# EAGLE design buttons (EAGLE 9.6.2)
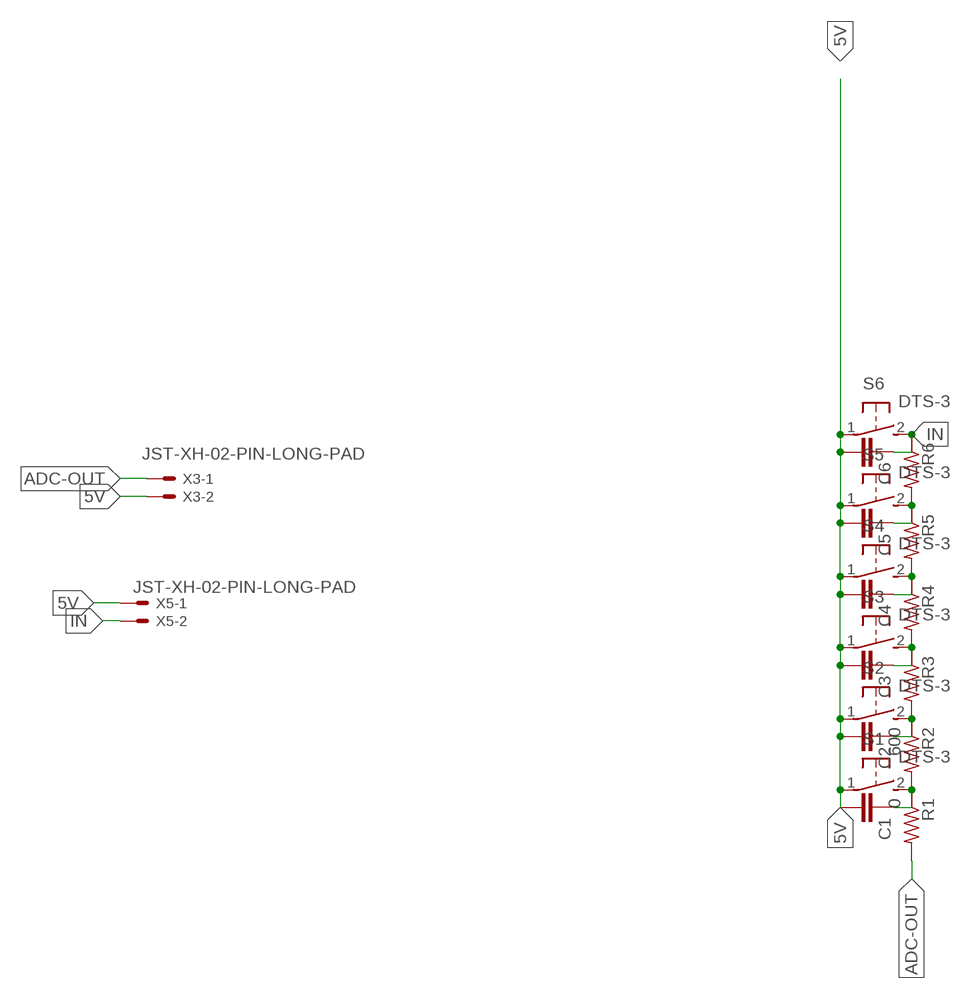
[diagram p0: schematic, sheet 1]

## Parts
C1  C-EU025-024X044  [C025-024X044]
C2  C-EU025-024X044  [C025-024X044]
C3  C-EU025-024X044  [C025-024X044]
C4  C-EU025-024X044  [C025-024X044]
C5  C-EU025-024X044  [C025-024X044]
C6  C-EU025-024X044  [C025-024X044]
R1  0  R-US_0204/7  [0204/7]
R2  600  R-US_0204/7  [0204/7]
R3  R-US_0204/7  [0204/7]
R4  R-US_0204/7  [0204/7]
R5  R-US_0204/7  [0204/7]
R6  R-US_0204/7  [0204/7]
S1  DTS-3  [DTS-3]
S2  DTS-3  [DTS-3]
S3  DTS-3  [DTS-3]
S4  DTS-3  [DTS-3]
S5  DTS-3  [DTS-3]
S6  DTS-3  [DTS-3]
X3  JST-XH-02-PIN-LONG-PAD  [JST-XH-02-PACKAGE-LONG-PAD]
X5  JST-XH-02-PIN-LONG-PAD  [JST-XH-02-PACKAGE-LONG-PAD]

## Nets
5V: C1.2 C2.2 C3.2 C4.2 C5.2 C6.2 S1.1 S2.1 S3.1 S4.1 S5.1 S6.1 X3.2 X5.1
ADC-OUT: R1.2 X3.1
IN: C6.1 R6.1 S6.2 X5.2
N$1: C1.1 R1.1 R2.2 S1.2
N$3: C2.1 R2.1 R3.2 S2.2
N$5: C3.1 R3.1 R4.2 S3.2
N$7: C4.1 R4.1 R5.2 S4.2
N$9: C5.1 R5.1 R6.2 S5.2

## Library data of the parts
C1-C6 = rcl:C-EU: CAPACITOR, European symbol; SPICEPREFIX: C
R1-R6 = rcl:R-US_: RESISTOR, American symbol; SPICEPREFIX: R
S1-S6 = switch-tact:DTS-3
X3 X5 = connector-data - JST XH Connectors v1-0:JST-XH-02-PIN: JST XH Connector 2 Pin Wire to board connector. Pitch: 2,54 mm, (0.100") Number of pins: 2 Created by Rembrandt Electronics www.rembrandtelectronics.com

## Board
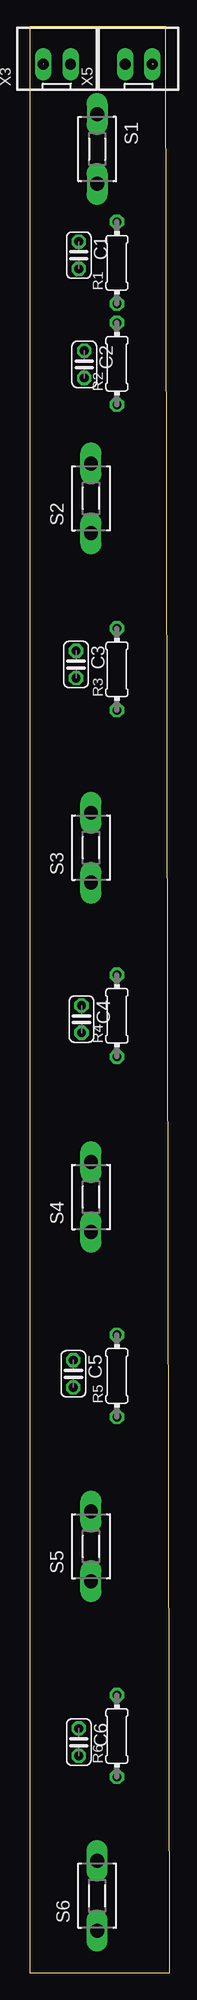
[diagram p1: board, top side]
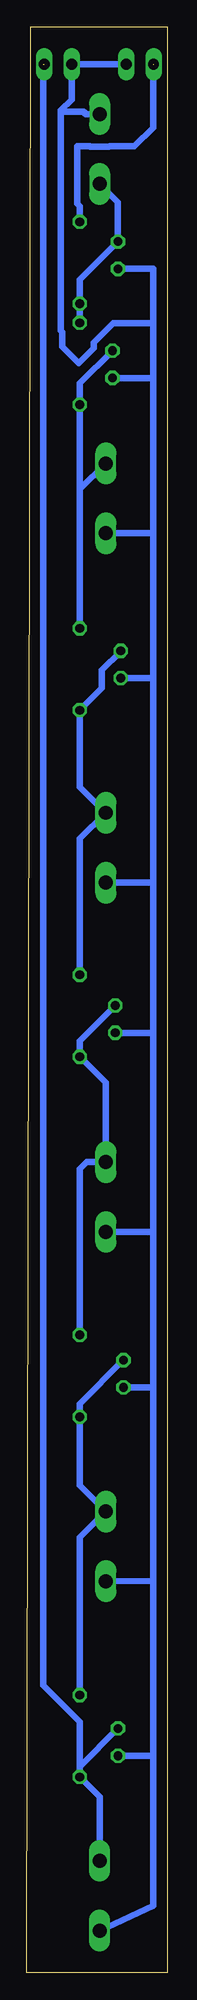
[diagram p2: board, bottom side, seen from below]

Size 13.06 x 181.15 mm. Coordinates in mm from the lower left corner, seen from the top.
Outline: 0,0 13.06,0 12.68,181.15 0,181.15 0,0
Copper layers (1*16): Top 0.035mm / dielectric 1.5mm / Bottom 0.035mm
Design rules "default *": minimum track width 6mil, minimum drill 0.35mm, track to track 0.8mm, track to pad 0.8mm, pad to pad 0.8mm, via to via 0.8mm, smd to smd 6mil, copper to edge 40mil, drill to drill 6mil, minimum pad ring 10mil, minimum via ring 8mil, stop-mask expansion 4mil, vias tented up to drill 0mil, thermal gap 10mil

### Footprints (pad centres in the part's own frame; a part is rotated, then mirrored left to right if it is on the bottom)
C025-024X044 = drill 0.813 octagon: 1 -1.27,0; 2 1.27,0
0204/7 = drill 0.813 octagon: 1 -3.81,0; 2 3.81,0
DTS-3 = drill 1.3 long: 1 -3.25,0; 2 3.25,0
JST-XH-02-PACKAGE-LONG-PAD = drill 1.016 long: 1 -1.27,0; 2 1.27,0

### Placement (x,y rotation side)
C1  4.58,159.89 270 top
C2  5.09,149.73 270 top
C3  4.33,121.79 270 top
C4  4.83,88.77 270 top
C5  4.07,55.75 270 top
C6  4.58,21.46 270 top
R1  8.13,159.19 90 top
R2  8.13,149.79 90 top
R3  8.13,121.34 90 top
R4  8.13,89.09 90 top
R5  8.13,55.56 90 top
R6  8.13,22.03 90 top
S1  6.29,169.78 270 top
S2  5.72,137.26 90 top
S3  5.72,104.73 90 top
S4  5.72,72.21 90 top
S5  5.72,39.69 90 top
S6  6.29,7.16 90 top
X3  2.54,177.67 0 top
X5  10.16,177.67 0 top

### Tracks (layer width: path | path; a pad name or v marks a point on that pad's centre or on a via)
5V
  Bottom 0.6: 1.32,68.94 1.32,87.5 | 1.32,87.5 1.32,101.49 | 1.32,101.49 1.32,120.52 | 1.32,120.52 1.32,134.01 | 1.32,134.01 1.32,148.46 | 1.32,148.46 1.32,153.54 | 1.32,153.54 1.32,158.62 C1.2 | C2.2 1.32,148.46 | S2.1 1.32,134.01 | C3.2 1.32,120.52 | S3.1 1.32,101.49 | C4.2 1.32,87.5 | S4.1 1.32,68.94 | S6.1 1.32,6.22 1.32,20.19 | 1.32,68.94 1.32,54.48 | 1.32,54.48 1.32,36.46 | 1.32,36.46 1.32,20.19 | C6.2 1.32,20.19 | S5.1 1.32,36.46 | C5.2 1.32,54.48 | X3.2 X5.1 8.89,174.37 9.89,173.37 | 1.32,153.54 5.04,153.54 6.85,151.73 6.85,151.22 8.23,149.84 9.76,151.36 9.76,152.74 9.89,152.87 9.89,173.37 | S1.1 7.57,173.03 7.79,173.25 9.76,173.25 9.89,173.37
ADC-OUT  (1 unrouted)
  Bottom 0.6: R1.2 8.13,164.46 8.37,164.69 8.37,170.05 7.22,170.05 7.15,169.98 5.43,169.98 5.36,170.05 3.05,170.05 1.32,171.79 1.32,177.67
IN  (1 unrouted)
  Bottom 0.6: S6.2 6.29,16.38 R6.1 | C6.1 8.13,19.19 R6.1 | R6.1 8.13,23.35 11.52,26.74 11.52,177.67
N$1
  Bottom 0.6: R2.2 R1.1 8.13,157.62 C1.1 4.58,164.82 S1.2
N$3
  Bottom 0.6: R3.2 8.13,138.09 | 8.13,138.09 S2.2 | 8.13,138.09 R2.1 8.13,147.96 C2.1
N$5
  Bottom 0.6: R4.2 8.13,105.57 5.73,107.97 | 5.73,107.97 S3.2 | 5.73,107.97 8.13,110.36 R3.1 6.09,119.58 6.09,121.25 4.33,123.01 C3.1
N$7
  Bottom 0.6: R5.2 8.13,74.8 7.47,75.46 S4.2 5.72,82.86 R4.1 8.13,86.75 C4.1
N$9
  Bottom 0.6: R6.2 8.13,40.52 S5.2 8.13,45.35 R5.1 8.13,52.97 C5.1